# Altium schematic sheet LightLink_V4.SchDoc
size C; SheetNumber: 1; SheetTotal: 5
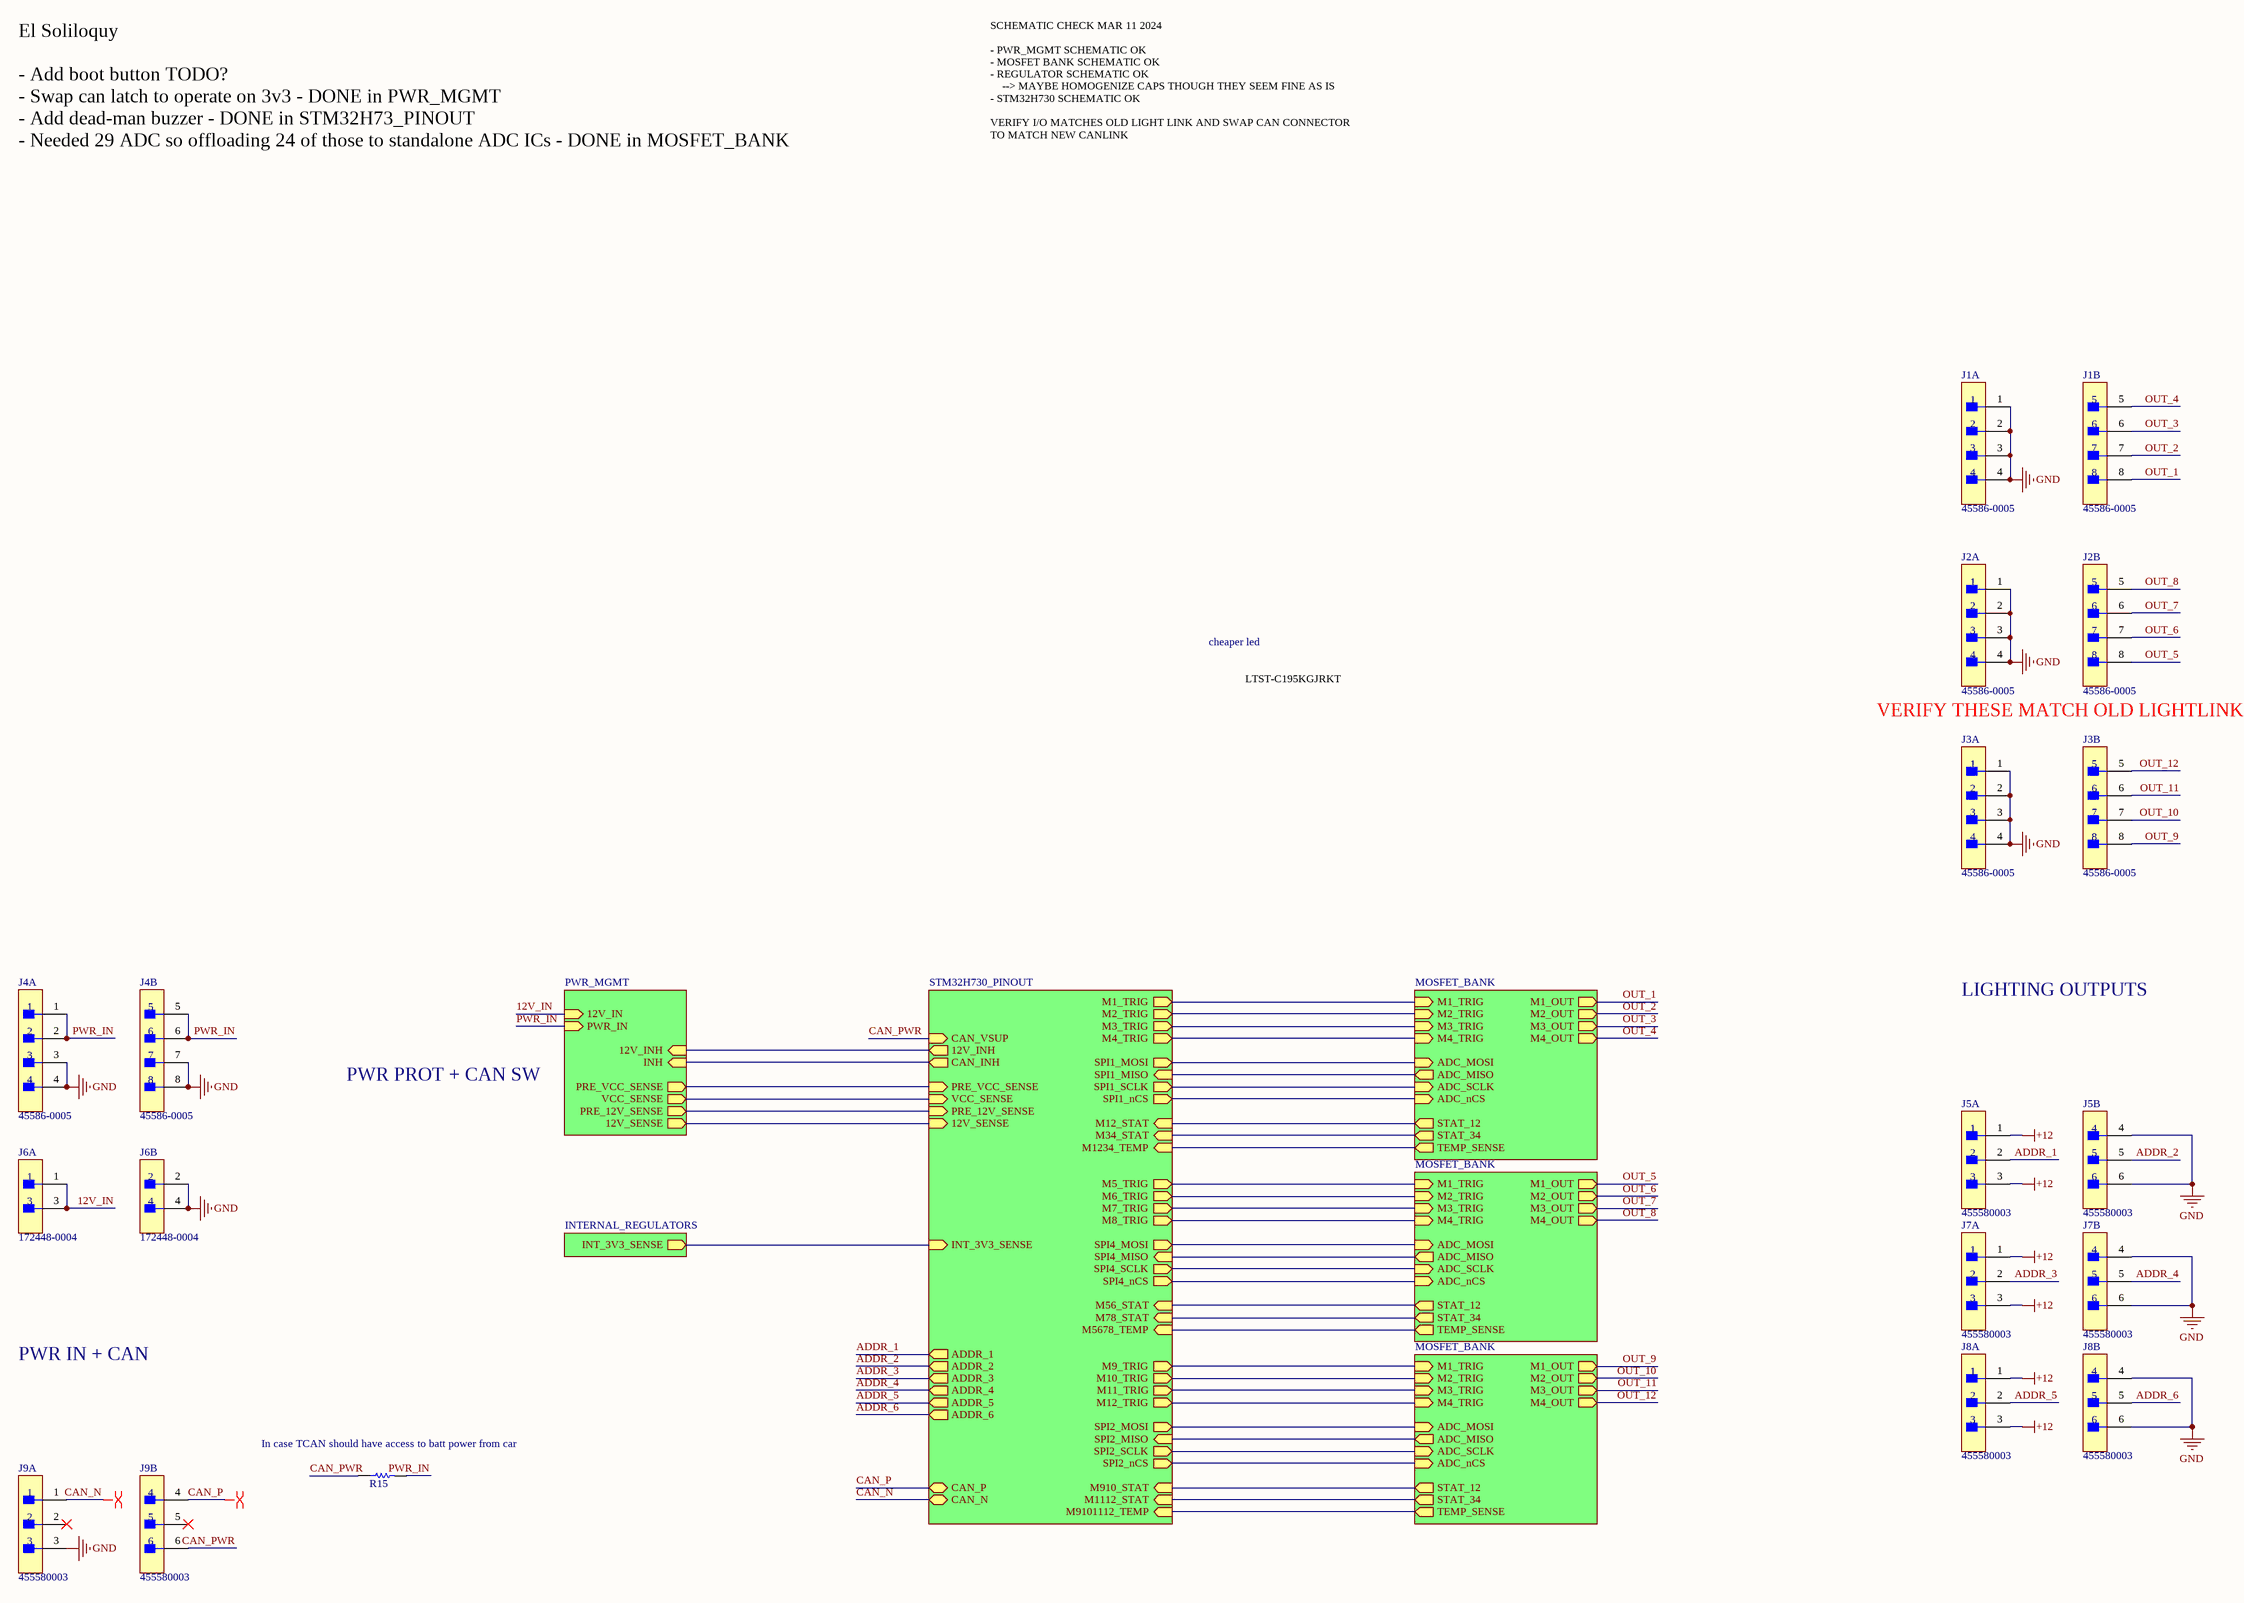
[diagram p0: LightLink_V4.SchDoc]

## Parts
J1  45586-0005  [FP-45586-0005-MFG]  (parts A,B of 2)
J2  45586-0005  [FP-45586-0005-MFG]  (parts A,B of 2)
J3  45586-0005  [FP-45586-0005-MFG]  (parts A,B of 2)
J4  45586-0005  [FP-45586-0005-MFG]  (parts A,B of 2)
J5  455580003  [FP-455580003-MFG]  (parts A,B of 2)
J6  172448-0004  [FP-39-30-1041-MFG]  (parts A,B of 2)
J7  455580003  [FP-455580003-MFG]  (parts A,B of 2)
J8  455580003  [FP-455580003-MFG]  (parts A,B of 2)
J9  455580003  [FP-455580003-MFG]  (parts A,B of 2)
R15  0603 JUMPER  [RESC1609X55X30ML15T15]  (value not drawn)

## Sub-sheets
INTERNAL_REGULATORS = INTERNAL_REGULATORS: INT_3V3_SENSE (out)
MOSFET_BANK = MOSFET_BANK: M1_OUT (out), M2_OUT (out), M3_OUT (out), M4_OUT (out), M1_TRIG (in), M2_TRIG (in), M3_TRIG (in), M4_TRIG (in), STAT_12 (out), STAT_34 (out), ADC_MOSI (in), ADC_MISO (out), ADC_SCLK (in), ADC_nCS (in), TEMP_SENSE (out)
MOSFET_BANK = MOSFET_BANK: M1_OUT (out), M2_OUT (out), M3_OUT (out), M4_OUT (out), M1_TRIG (in), M2_TRIG (in), M3_TRIG (in), M4_TRIG (in), STAT_12 (out), STAT_34 (out), ADC_MOSI (in), ADC_MISO (out), ADC_SCLK (in), ADC_nCS (in), TEMP_SENSE (out)
MOSFET_BANK = MOSFET_BANK: M1_OUT (out), M2_OUT (out), M3_OUT (out), M4_OUT (out), M1_TRIG (in), M2_TRIG (in), M3_TRIG (in), M4_TRIG (in), STAT_12 (out), STAT_34 (out), ADC_MOSI (in), ADC_MISO (out), ADC_SCLK (in), ADC_nCS (in), TEMP_SENSE (out)
PWR_MGMT = PWR_MGMT: PWR_IN (in), 12V_IN (in), PRE_VCC_SENSE (out), VCC_SENSE (out), PRE_12V_SENSE (out), 12V_SENSE (out), INH (in), 12V_INH (in)
STM32H730_PINOUT = STM32H730_PINOUT: CAN_P (bidir), CAN_N (bidir), M1_TRIG (out), M2_TRIG (out), M3_TRIG (out), M4_TRIG (out), M12_STAT (in), M34_STAT (in), PRE_VCC_SENSE (in), VCC_SENSE (in), PRE_12V_SENSE (in), 12V_SENSE (in), M5_TRIG (out), M6_TRIG (out), M7_TRIG (out), M8_TRIG (out), M9_TRIG (out), M10_TRIG (out), M11_TRIG (out), M12_TRIG (out), M56_STAT (in), M78_STAT (in), M910_STAT (in), M1112_STAT (in), INT_3V3_SENSE (in), ADDR_1 (out), ADDR_2 (out), ADDR_3 (out), ADDR_4 (out), ADDR_5 (out), ADDR_6 (out), CAN_VSUP (in), CAN_INH (out), SPI1_MOSI (out), SPI1_MISO (in), SPI1_SCLK (out), SPI1_nCS (out), SPI4_MOSI (out), SPI4_MISO (in), SPI4_SCLK (out), SPI4_nCS (out), SPI2_MOSI (out), SPI2_MISO (in), SPI2_SCLK (out), SPI2_nCS (out), M1234_TEMP (in), M5678_TEMP (in), M9101112_TEMP (in), 12V_INH (out)

## Nets
+12: J5.1 J5.3 J7.1 J7.3 J8.1 J8.3
GND: J1.1 J1.2 J1.3 J1.4 J2.1 J2.2 J2.3 J2.4 J3.1 J3.2 J3.3 J3.4 J4.3 J4.4 J4.7 J4.8 J5.4 J5.6 J6.2 J6.4 J7.4 J7.6 J8.4 J8.6 J9.3
12V_IN: J6.1 J6.3 ; sheet PWR_MGMT/12V_IN
ADDR_1: J5.2 ; sheet STM32H730_PINOUT/ADDR_1
ADDR_2: J5.5 ; sheet STM32H730_PINOUT/ADDR_2
ADDR_3: J7.2 ; sheet STM32H730_PINOUT/ADDR_3
ADDR_4: J7.5 ; sheet STM32H730_PINOUT/ADDR_4
ADDR_5: J8.2 ; sheet STM32H730_PINOUT/ADDR_5
ADDR_6: J8.5 ; sheet STM32H730_PINOUT/ADDR_6
CAN_N: J9.1 ; sheet STM32H730_PINOUT/CAN_N
CAN_P: J9.4 ; sheet STM32H730_PINOUT/CAN_P
CAN_PWR: J9.6 R15.1 ; sheet STM32H730_PINOUT/CAN_VSUP
OUT_1: J1.8 ; sheet MOSFET_BANK/M1_OUT
OUT_2: J1.7 ; sheet MOSFET_BANK/M2_OUT
OUT_3: J1.6 ; sheet MOSFET_BANK/M3_OUT
OUT_4: J1.5 ; sheet MOSFET_BANK/M4_OUT
OUT_5: J2.8 ; sheet MOSFET_BANK/M1_OUT
OUT_6: J2.7 ; sheet MOSFET_BANK/M2_OUT
OUT_7: J2.6 ; sheet MOSFET_BANK/M3_OUT
OUT_8: J2.5 ; sheet MOSFET_BANK/M4_OUT
OUT_9: J3.8 ; sheet MOSFET_BANK/M1_OUT
OUT_10: J3.7 ; sheet MOSFET_BANK/M2_OUT
OUT_11: J3.6 ; sheet MOSFET_BANK/M3_OUT
OUT_12: J3.5 ; sheet MOSFET_BANK/M4_OUT
PWR_IN: J4.1 J4.2 J4.5 J4.6 R15.2 ; sheet PWR_MGMT/PWR_IN
(unnamed): sheet PWR_MGMT/PRE_VCC_SENSE, sheet STM32H730_PINOUT/PRE_VCC_SENSE
(unnamed): sheet PWR_MGMT/VCC_SENSE, sheet STM32H730_PINOUT/VCC_SENSE
(unnamed): sheet PWR_MGMT/PRE_12V_SENSE, sheet STM32H730_PINOUT/PRE_12V_SENSE
(unnamed): sheet PWR_MGMT/12V_SENSE, sheet STM32H730_PINOUT/12V_SENSE
(unnamed): sheet PWR_MGMT/INH, sheet STM32H730_PINOUT/CAN_INH
(unnamed): sheet PWR_MGMT/12V_INH, sheet STM32H730_PINOUT/12V_INH
(unnamed): sheet INTERNAL_REGULATORS/INT_3V3_SENSE, sheet STM32H730_PINOUT/INT_3V3_SENSE
(unnamed): sheet STM32H730_PINOUT/M1_TRIG, sheet MOSFET_BANK/M1_TRIG
(unnamed): sheet STM32H730_PINOUT/M2_TRIG, sheet MOSFET_BANK/M2_TRIG
(unnamed): sheet STM32H730_PINOUT/M3_TRIG, sheet MOSFET_BANK/M3_TRIG
(unnamed): sheet STM32H730_PINOUT/M4_TRIG, sheet MOSFET_BANK/M4_TRIG
(unnamed): sheet STM32H730_PINOUT/M12_STAT, sheet MOSFET_BANK/STAT_12
(unnamed): sheet STM32H730_PINOUT/M34_STAT, sheet MOSFET_BANK/STAT_34
(unnamed): sheet STM32H730_PINOUT/M5_TRIG, sheet MOSFET_BANK/M1_TRIG
(unnamed): sheet STM32H730_PINOUT/M6_TRIG, sheet MOSFET_BANK/M2_TRIG
(unnamed): sheet STM32H730_PINOUT/M7_TRIG, sheet MOSFET_BANK/M3_TRIG
(unnamed): sheet STM32H730_PINOUT/M8_TRIG, sheet MOSFET_BANK/M4_TRIG
(unnamed): sheet STM32H730_PINOUT/M9_TRIG, sheet MOSFET_BANK/M1_TRIG
(unnamed): sheet STM32H730_PINOUT/M10_TRIG, sheet MOSFET_BANK/M2_TRIG
(unnamed): sheet STM32H730_PINOUT/M11_TRIG, sheet MOSFET_BANK/M3_TRIG
(unnamed): sheet STM32H730_PINOUT/M12_TRIG, sheet MOSFET_BANK/M4_TRIG
(unnamed): sheet STM32H730_PINOUT/M56_STAT, sheet MOSFET_BANK/STAT_12
(unnamed): sheet STM32H730_PINOUT/M78_STAT, sheet MOSFET_BANK/STAT_34
(unnamed): sheet STM32H730_PINOUT/M910_STAT, sheet MOSFET_BANK/STAT_12
(unnamed): sheet STM32H730_PINOUT/M1112_STAT, sheet MOSFET_BANK/STAT_34
(unnamed): sheet STM32H730_PINOUT/SPI1_MOSI, sheet MOSFET_BANK/ADC_MOSI
(unnamed): sheet STM32H730_PINOUT/SPI1_MISO, sheet MOSFET_BANK/ADC_MISO
(unnamed): sheet STM32H730_PINOUT/SPI1_SCLK, sheet MOSFET_BANK/ADC_SCLK
(unnamed): sheet STM32H730_PINOUT/SPI1_nCS, sheet MOSFET_BANK/ADC_nCS
(unnamed): sheet STM32H730_PINOUT/SPI4_MOSI, sheet MOSFET_BANK/ADC_MOSI
(unnamed): sheet STM32H730_PINOUT/SPI4_MISO, sheet MOSFET_BANK/ADC_MISO
(unnamed): sheet STM32H730_PINOUT/SPI4_SCLK, sheet MOSFET_BANK/ADC_SCLK
(unnamed): sheet STM32H730_PINOUT/SPI4_nCS, sheet MOSFET_BANK/ADC_nCS
(unnamed): sheet STM32H730_PINOUT/SPI2_MOSI, sheet MOSFET_BANK/ADC_MOSI
(unnamed): sheet STM32H730_PINOUT/SPI2_MISO, sheet MOSFET_BANK/ADC_MISO
(unnamed): sheet STM32H730_PINOUT/SPI2_SCLK, sheet MOSFET_BANK/ADC_SCLK
(unnamed): sheet STM32H730_PINOUT/SPI2_nCS, sheet MOSFET_BANK/ADC_nCS
(unnamed): sheet STM32H730_PINOUT/M1234_TEMP, sheet MOSFET_BANK/TEMP_SENSE
(unnamed): sheet STM32H730_PINOUT/M5678_TEMP, sheet MOSFET_BANK/TEMP_SENSE
(unnamed): sheet STM32H730_PINOUT/M9101112_TEMP, sheet MOSFET_BANK/TEMP_SENSE

Not connected (* = marked no-connect by the designer): J9 2* 5*

## Layout directives
differential pair: CAN_N, CAN_P

## Notes on the sheet
- SCHEMATIC CHECK MAR 11 2024
  - PWR_MGMT SCHEMATIC OK
  - MOSFET BANK SCHEMATIC OK
  - REGULATOR SCHEMATIC OK
  --> MAYBE HOMOGENIZE CAPS THOUGH THEY SEEM FINE AS IS
  - STM32H730 SCHEMATIC OK
  VERIFY I/O MATCHES OLD LIGHT LINK AND SWAP CAN CONNECTOR TO MATCH NEW CANLINK
- cheaper led
- LTST-C195KGJRKT
- (near J2) VERIFY THESE MATCH OLD LIGHTLINK
- El Soliloquy
  - Add boot button TODO?
  - Swap can latch to operate on 3v3 - DONE in PWR_MGMT
  - Add dead-man buzzer - DONE in STM32H73_PINOUT
  - Needed 29 ADC so offloading 24 of those to standalone ADC ICs - DONE in MOSFET_BANK
- LIGHTING OUTPUTS
- PWR PROT + CAN SW
- PWR IN + CAN
- (near R15) In case TCAN should have access to batt power from car

## Library data of the parts
J1-J4 = CMP-04776-000690-1: CONN HEADER R/A 8POS 4.2MM
J5 J7-J9 = CMP-04776-000024-1: CONN HEADER R/A 6POS 4.2MM; Manufacturer: Molex; Standoff Height: 0.4mm; Conn Orientation: Right Angle; Number Of Contacts: 6; Conn Gender: Male; Voltage Rating: 600V; Current Rating: 8A; Footprint Url: https://www.molex.com/pdm_docs/sd/455580003_sd.pdf; Number Of Rows: 2; Lead Free: Yes; Digikey Description: CONN HEADER R/A 6POS 4.2MM; ComponentLink2URL: https://www.molex.com/webdocs/datasheets/pdf/en-us/0455580003_PCB_HEADERS.pdf; Octopart: https://octopart.com/45558-0003-molex-7672845; Package: 0; Device Class L3: unset; ComponentLink2Description: Datasheet; Device Class L2: Headers and Wire Housings; Category: Conn; Contact Material: Tin,Nickel; Mouser Description: Conn Power HDR 6 POS 4.2mm Solder ST Thru-Hole 6 Terminal 1 Port Mini-Fit Jr™ Tray; Manufacturer Part Number: 455580003; Pitch: 4.2mm; Device Class L1: Connectors; Temperature Range Low: -40°C; Temperature: -40°C to +105°C; RoHS: TRUE; Temperature Range High: +105°C; Height: 10.38mm; Automotive: No
J6 = CMP-04776-000047-1: Different component but holes should line up. Original P/N is 39-30-1041; Manufacturer: Molex; Old_Part_Number: 5569-04A2G; Keying_to_Mating_Part: None; Circuits_maximum: 4; First_Mate__Last_Break: No; Lead_freeProcess_Capability: WAVE; Duration_at_Max_Process_Temperature_seconds: 005; Sales_Drawing: SDA-5569-NA2*-*; Current Rating: 13A; Material___Plating_Mating: Gold; Conn Gender: Male; Test_Summary: TS-5556-002; Color___Resin: Natural; Termination_Interface_Style: Through Hole; Pitch___Termination_Interface: 4.20mm; UL: E29179; PCB_Retention: Yes; Product_Name: Mini-Fit Jr.TM; Material___Resin: Nylon; Overview: Mini-Fit Jr. Power Connectors; CSA: LR19980; Plating_min___Termination: 2.540μm; Packaging_Type: Bag; Number_of_Rows: 2; Durability_mating_cycles_max: 30; Max_Cycles_at_Max_Process_Temperature: 001; Product_Specification: PS-45750-001, PS-5556-001; Net_Weight: 1.529/g; Voltage___Maximum: 600V; Material___Metal: Brass; Pitch: 4.2mm; Packaging_Specification: PK-5569-002; Shrouded: Fully; Plating_min___Mating: 0.762μm; Temperature_Range___Operating: -40°C to +105°C; Current___Maximum_per_Contact: 13.0A; Comments: Current = 13A max. per circuit when header is mated to a receptacle loaded with  45750  Mini-Fit® Plus HCS Crimp Terminal Crimped to 16 AWG wire.,  See Molex Product specification PS-5556-001 for additional current de-rating information.; Process_Temperature_max_C: 240; PCB_Thickness___Recommended: 1.78mm; Standoff Height: 0.016inch; Surface_Mount_Compatible_SMC: No; UPC: 800753579651; Conn Orientation: Right Angle; Material___Plating_Termination: Matte Tin; ComponentLink2Description: Datasheet; Footprint Url: https://www.molex.com/pdm_docs/sd/039301041_sd.pdf; Contact Material: Gold,Nickel; Octopart: https://octopart.com/39-30-1041-molex-276737; Digikey Description: CONN HEADER R/A 4POS 4.2MM; imported: yes; Series: 5569; Mouser Description: Headers & Wire Housings 4 CKT R/A HEADER; Temperature Range High: +105°C; Category: Conn; Polarized_to_Mating_Part: Yes; Pitch___Mating_Interface: 4.20mm; Automotive: No; Guide_to_Mating_Part: No; Lock_to_Mating_Part: Yes; Number Of Contacts: 4; Temperature Range Low: -40°C; RoHS: TRUE; Status: Active; imported_from: 3D Model; ComponentLink2URL: http://www.molex.com/pdm_docs/sd/039301041_sd.pdf; part_page: http://www.molex.com/molex/products/datasheet.jsp?part=active/0039301041_PCB_HEADERS.xml; Temperature: -40°C to +105°C; Device Class L3: unset; Device Class L1: Connectors; Package: 39-30-1041; Circuits_Loaded: 4; Lead Free: Yes; Ipc Land Pattern Name: CAPAD1016W80L630D240; Application: Power, Wire-to-Board; Voltage Rating: 600V; Manufacturer Part Number: 39-30-1041; Breakaway: No; Orientation: Right Angle; Flammability: 94V-2; 3D_model: http://www.molex.com/pdm_docs/stp/39-30-1041_stp.zip; Number Of Rows: 2; Polarized_to_PCB: Yes; Device Class L2: Headers and Wire Housings; Glow_Wire_Compliant: No; Stackable: No; PCB_Locator: Yes
R15 = CMP-009-00209-1: READ THE NAME